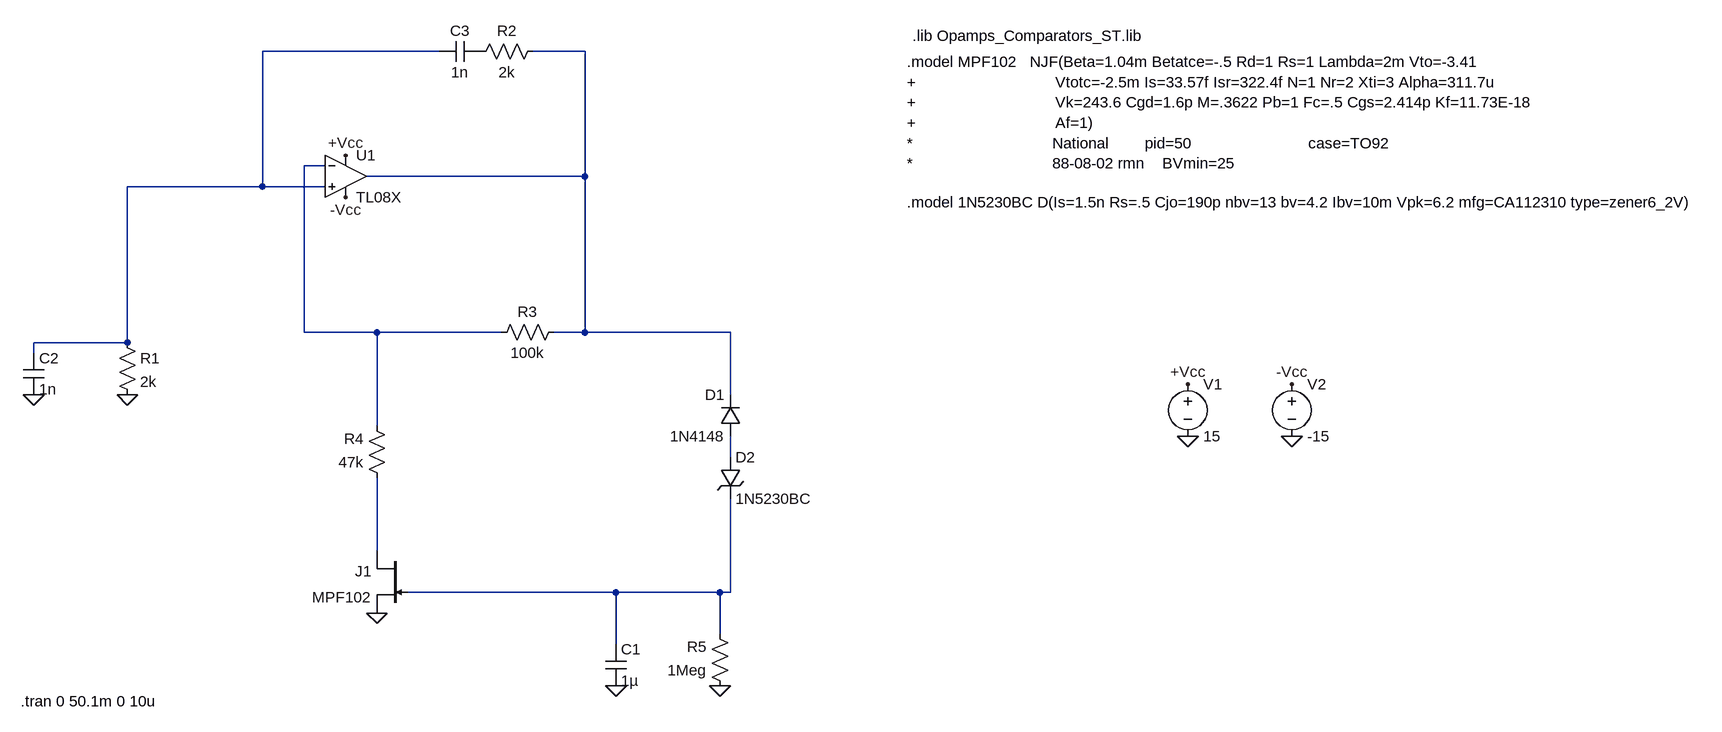
[diagram p0: schematic wien_oscilator.asc]
wien_oscilator.asc, the LTspice schematic file:
Version 4
SHEET 1 2700 808
WIRE 640 -208 368 -208
WIRE 864 -208 784 -208
WIRE 464 -32 432 -32
WIRE 864 -16 864 -208
WIRE 864 -16 528 -16
WIRE 368 0 368 -208
WIRE 368 0 160 0
WIRE 464 0 368 0
WIRE 432 224 432 -32
WIRE 544 224 432 224
WIRE 736 224 544 224
WIRE 864 224 864 -16
WIRE 864 224 816 224
WIRE 1088 224 864 224
WIRE 160 240 160 0
WIRE 160 240 16 240
WIRE 16 256 16 240
WIRE 1088 320 1088 224
WIRE 544 368 544 224
WIRE 1088 416 1088 384
WIRE 544 560 544 448
WIRE 912 624 592 624
WIRE 1072 624 912 624
WIRE 1088 624 1088 480
WIRE 1088 624 1072 624
WIRE 1072 688 1072 624
WIRE 912 704 912 624
FLAG 16 320 0
FLAG 160 320 0
FLAG 912 768 0
FLAG 1072 768 0
FLAG 544 656 0
FLAG 1792 384 0
FLAG 1952 384 0
FLAG 1792 304 +Vcc
FLAG 1952 304 -Vcc
FLAG 496 -48 +Vcc
FLAG 496 16 -Vcc
SYMBOL res 144 224 R0
SYMATTR InstName R1
SYMATTR Value 2k
SYMBOL res 800 -224 R90
WINDOW 0 0 56 VBottom 2
WINDOW 3 32 56 VTop 2
SYMATTR InstName R2
SYMATTR Value 2k
SYMBOL res 832 208 R90
WINDOW 0 0 56 VBottom 2
WINDOW 3 32 56 VTop 2
SYMATTR InstName R3
SYMATTR Value 100k
SYMBOL res 560 464 R180
WINDOW 0 36 76 Left 2
WINDOW 3 36 40 Left 2
SYMATTR InstName R4
SYMATTR Value 47k
SYMBOL res 1088 784 R180
WINDOW 0 36 76 Left 2
WINDOW 3 36 40 Left 2
SYMATTR InstName R5
SYMATTR Value 1Meg
SYMBOL Opamps\\opamp2 496 -80 R0
SYMATTR InstName U1
SYMATTR Value TL08X
SYMBOL cap 0 256 R0
SYMATTR InstName C2
SYMATTR Value 1n
SYMBOL cap 704 -224 R90
WINDOW 0 0 32 VBottom 2
WINDOW 3 32 32 VTop 2
SYMATTR InstName C3
SYMATTR Value 1n
SYMBOL diode 1104 384 R180
WINDOW 0 24 64 Left 2
WINDOW 3 24 0 Left 2
SYMATTR InstName D1
SYMATTR Value 1N4148
SYMBOL zener 1072 416 R0
SYMATTR InstName D2
SYMATTR Value 1N5230BC
SYMBOL njf 592 560 M0
SYMATTR InstName J1
SYMATTR Value MPF102
SYMBOL voltage 1792 288 R0
WINDOW 123 0 0 Left 0
WINDOW 39 0 0 Left 0
SYMATTR InstName V1
SYMATTR Value 15
SYMBOL voltage 1952 288 R0
WINDOW 123 0 0 Left 0
WINDOW 39 0 0 Left 0
SYMATTR InstName V2
SYMATTR Value -15
SYMBOL cap 896 704 R0
SYMATTR InstName C1
SYMATTR Value 1µ
TEXT 1368 -232 Left 2 !.lib Opamps_Comparators_ST.lib
TEXT -4 792 Left 2 !.tran 0 50.1m 0 10u
TEXT 1360 -192 Left 2 !.model MPF102   NJF(Beta=1.04m Betatce=-.5 Rd=1 Rs=1 Lambda=2m Vto=-3.41\n+                               Vtotc=-2.5m Is=33.57f Isr=322.4f N=1 Nr=2 Xti=3 Alpha=311.7u\n+                               Vk=243.6 Cgd=1.6p M=.3622 Pb=1 Fc=.5 Cgs=2.414p Kf=11.73E-18\n+                               Af=1)\n*                               National        pid=50                          case=TO92\n*                               88-08-02 rmn    BVmin=25
TEXT 1360 24 Left 2 !.model 1N5230BC D(Is=1.5n Rs=.5 Cjo=190p nbv=13 bv=4.2 Ibv=10m Vpk=6.2 mfg=CA112310 type=zener6_2V)

The netlist it stands for:
* wien_oscilator.asc
R1 N001 0 2k
R2 N002 P001 2k
R3 N002 N003 100k
R4 N005 N003 47k
R5 0 N006 1Meg
XU1 N001 N003 +Vcc -Vcc N002 TL08X  ; pins In+ In- V+ V- OUT
C2 N001 0 1n
C3 P001 N001 1n
D1 N004 N002 1N4148
D2 N004 N006 1N5230BC
J1 N005 N006 0 MPF102
V1 +Vcc 0 15
V2 -Vcc 0 -15
C1 N006 0 1µ
.model D D
.lib standard.dio
.model NJF NJF
.model PJF PJF
.lib standard.jft
.lib Opamps_Comparators_ST.lib
.tran 0 50.1m 0 10u
.model MPF102   NJF(Beta=1.04m Betatce=-.5 Rd=1 Rs=1 Lambda=2m Vto=-3.41
+                               Vtotc=-2.5m Is=33.57f Isr=322.4f N=1 Nr=2 Xti=3 Alpha=311.7u
+                               Vk=243.6 Cgd=1.6p M=.3622 Pb=1 Fc=.5 Cgs=2.414p Kf=11.73E-18
+                               Af=1)
*                               National        pid=50                          case=TO92
*                               88-08-02 rmn    BVmin=25
.model 1N5230BC D(Is=1.5n Rs=.5 Cjo=190p nbv=13 bv=4.2 Ibv=10m Vpk=6.2 mfg=CA112310 type=zener6_2V)
.backanno
.end